# Altium schematic sheet PowerSupply-SCH_SH2_(A).SchDoc: SCHEMATIC
size 863 x 558 mm; SheetNumber: 2; SheetTotal: 2; PageSetup: Record=PageOptions|CenterHorizontal=True|CenterVertical=True|PrintScale=0.98|XCorrection=1.00|YCorrection=1.00|PrintKind=2|BorderSize=5000000|LeftOffset=0|BottomOffset=0|Orientation=2|PaperLength=1000|PaperWidth=1000|Scale=100|PaperSource=15|PrintQuality=1200|MediaType=1|DitherType=10|PaperKind=11 x 17|PrintScaleMode=1
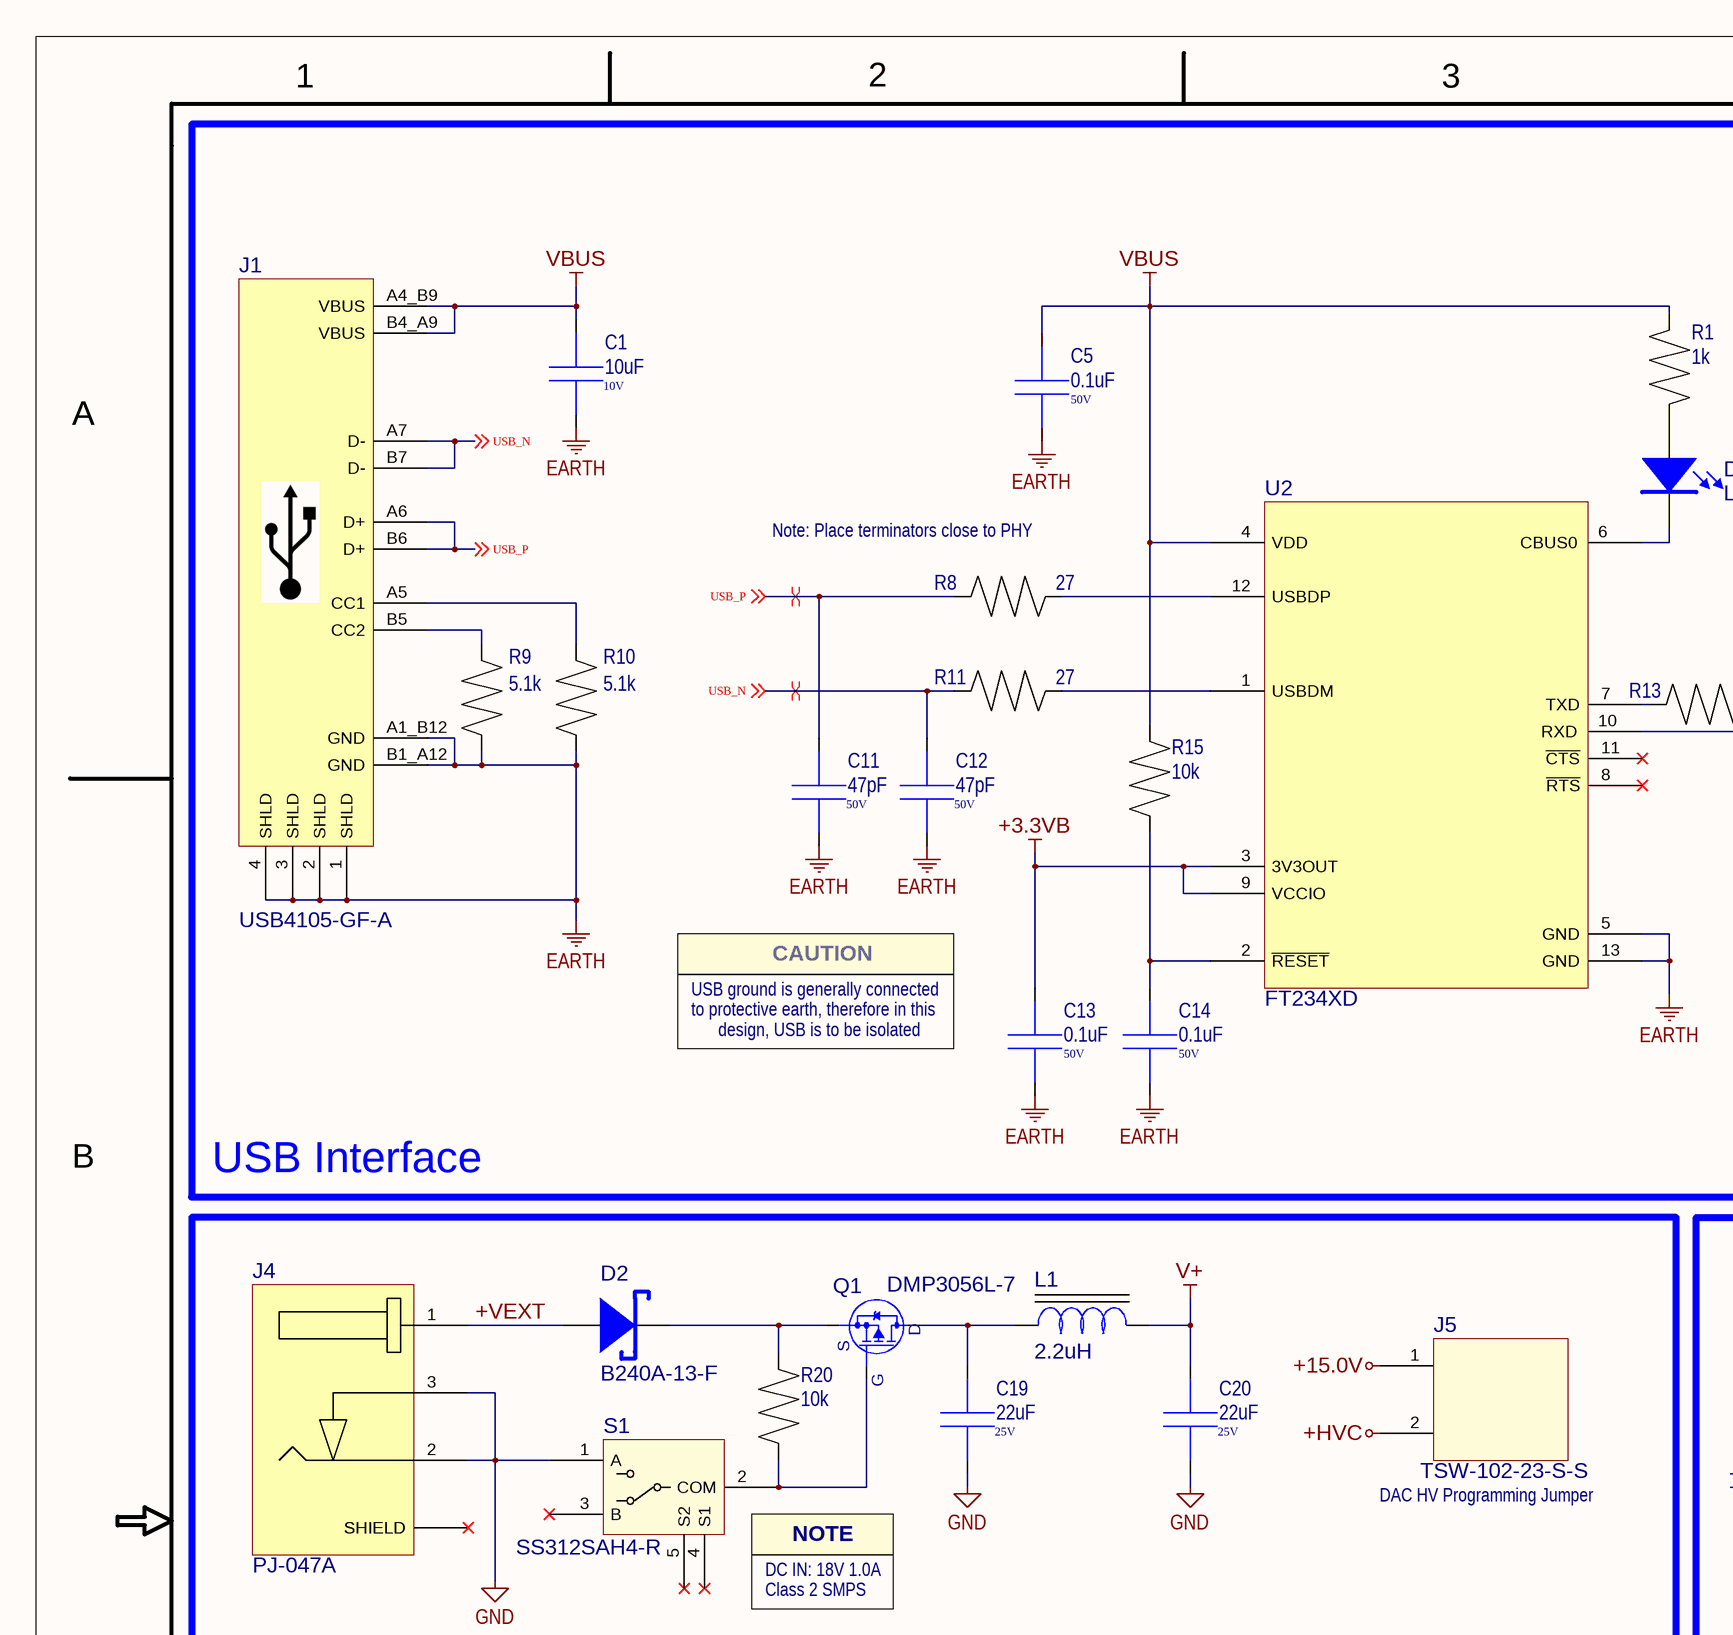
[diagram p0: PowerSupply-SCH_SH2_(A).SchDoc, top left]
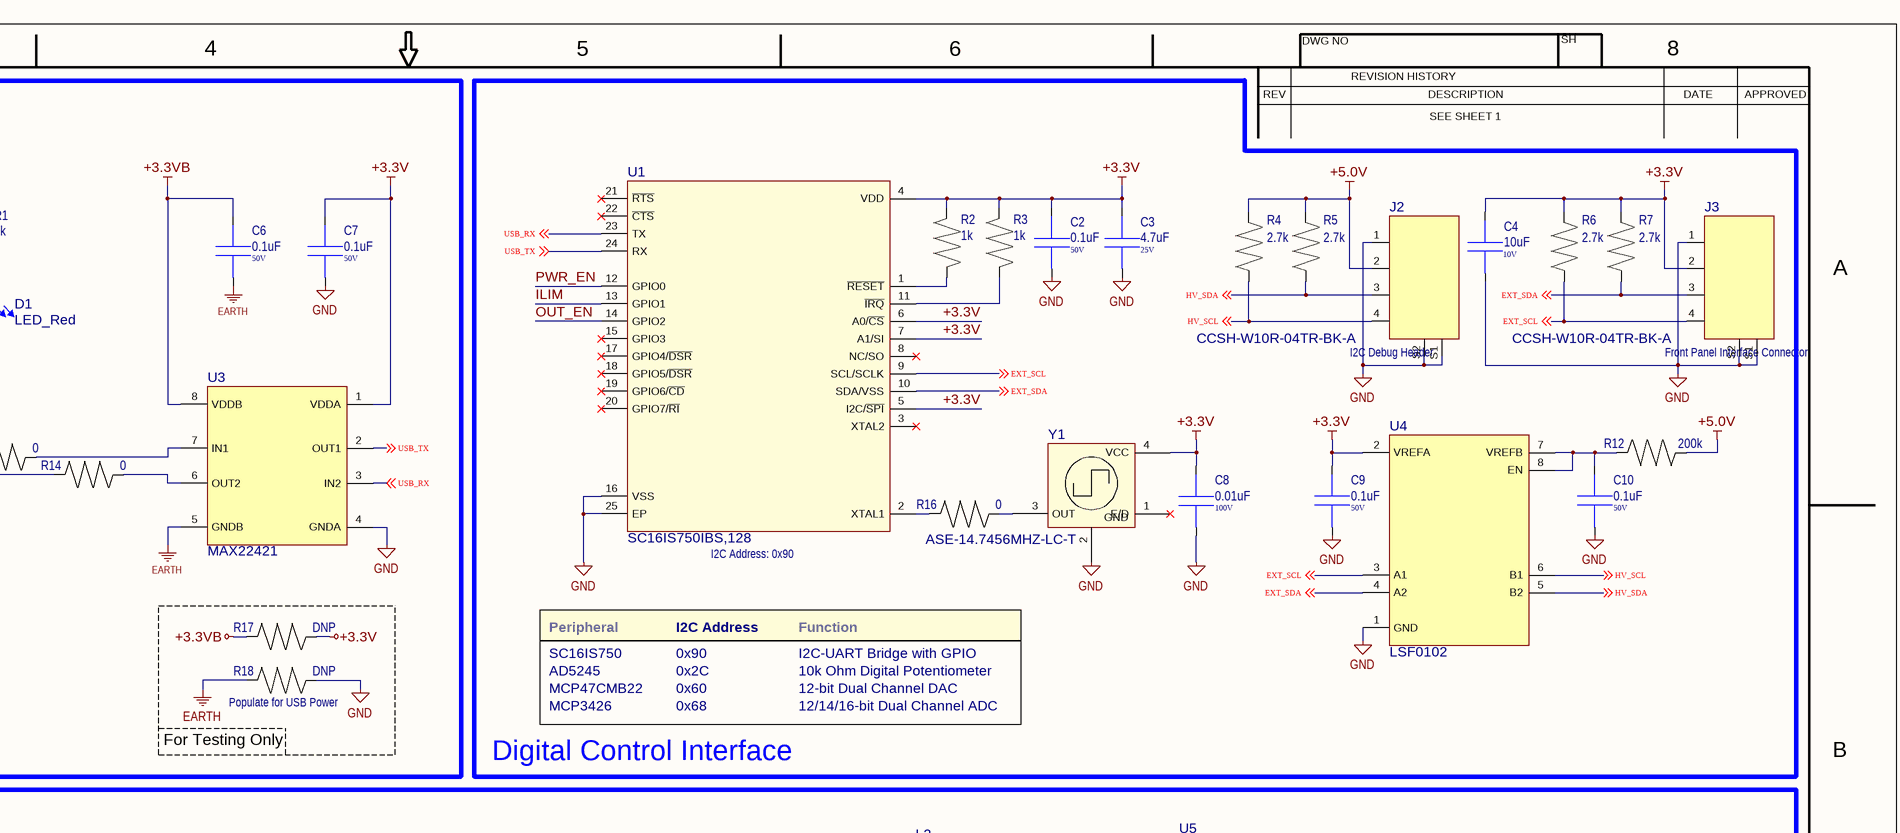
[diagram p1: PowerSupply-SCH_SH2_(A).SchDoc, top right]
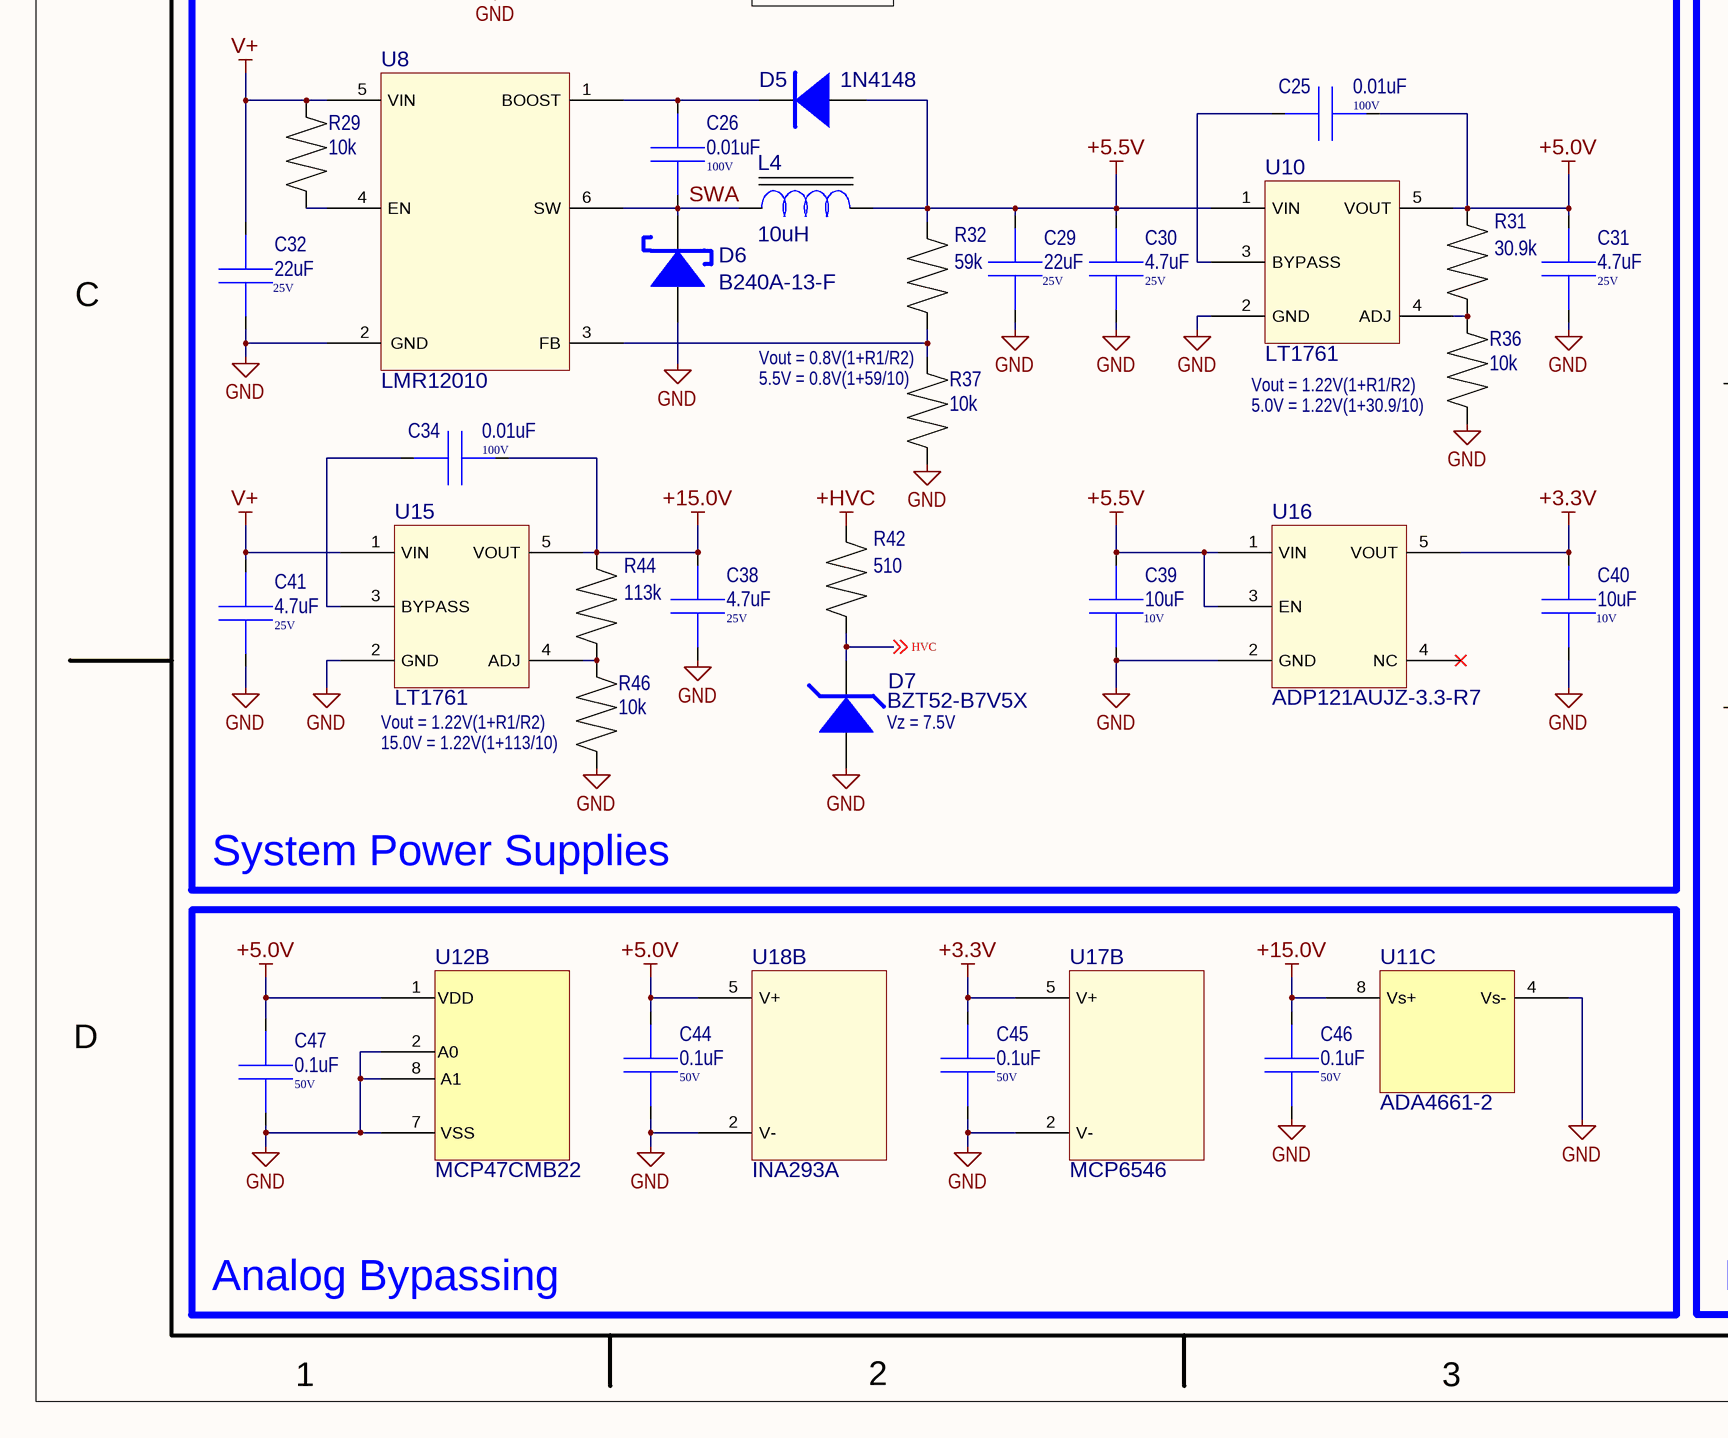
[diagram p2: PowerSupply-SCH_SH2_(A).SchDoc, bottom left]
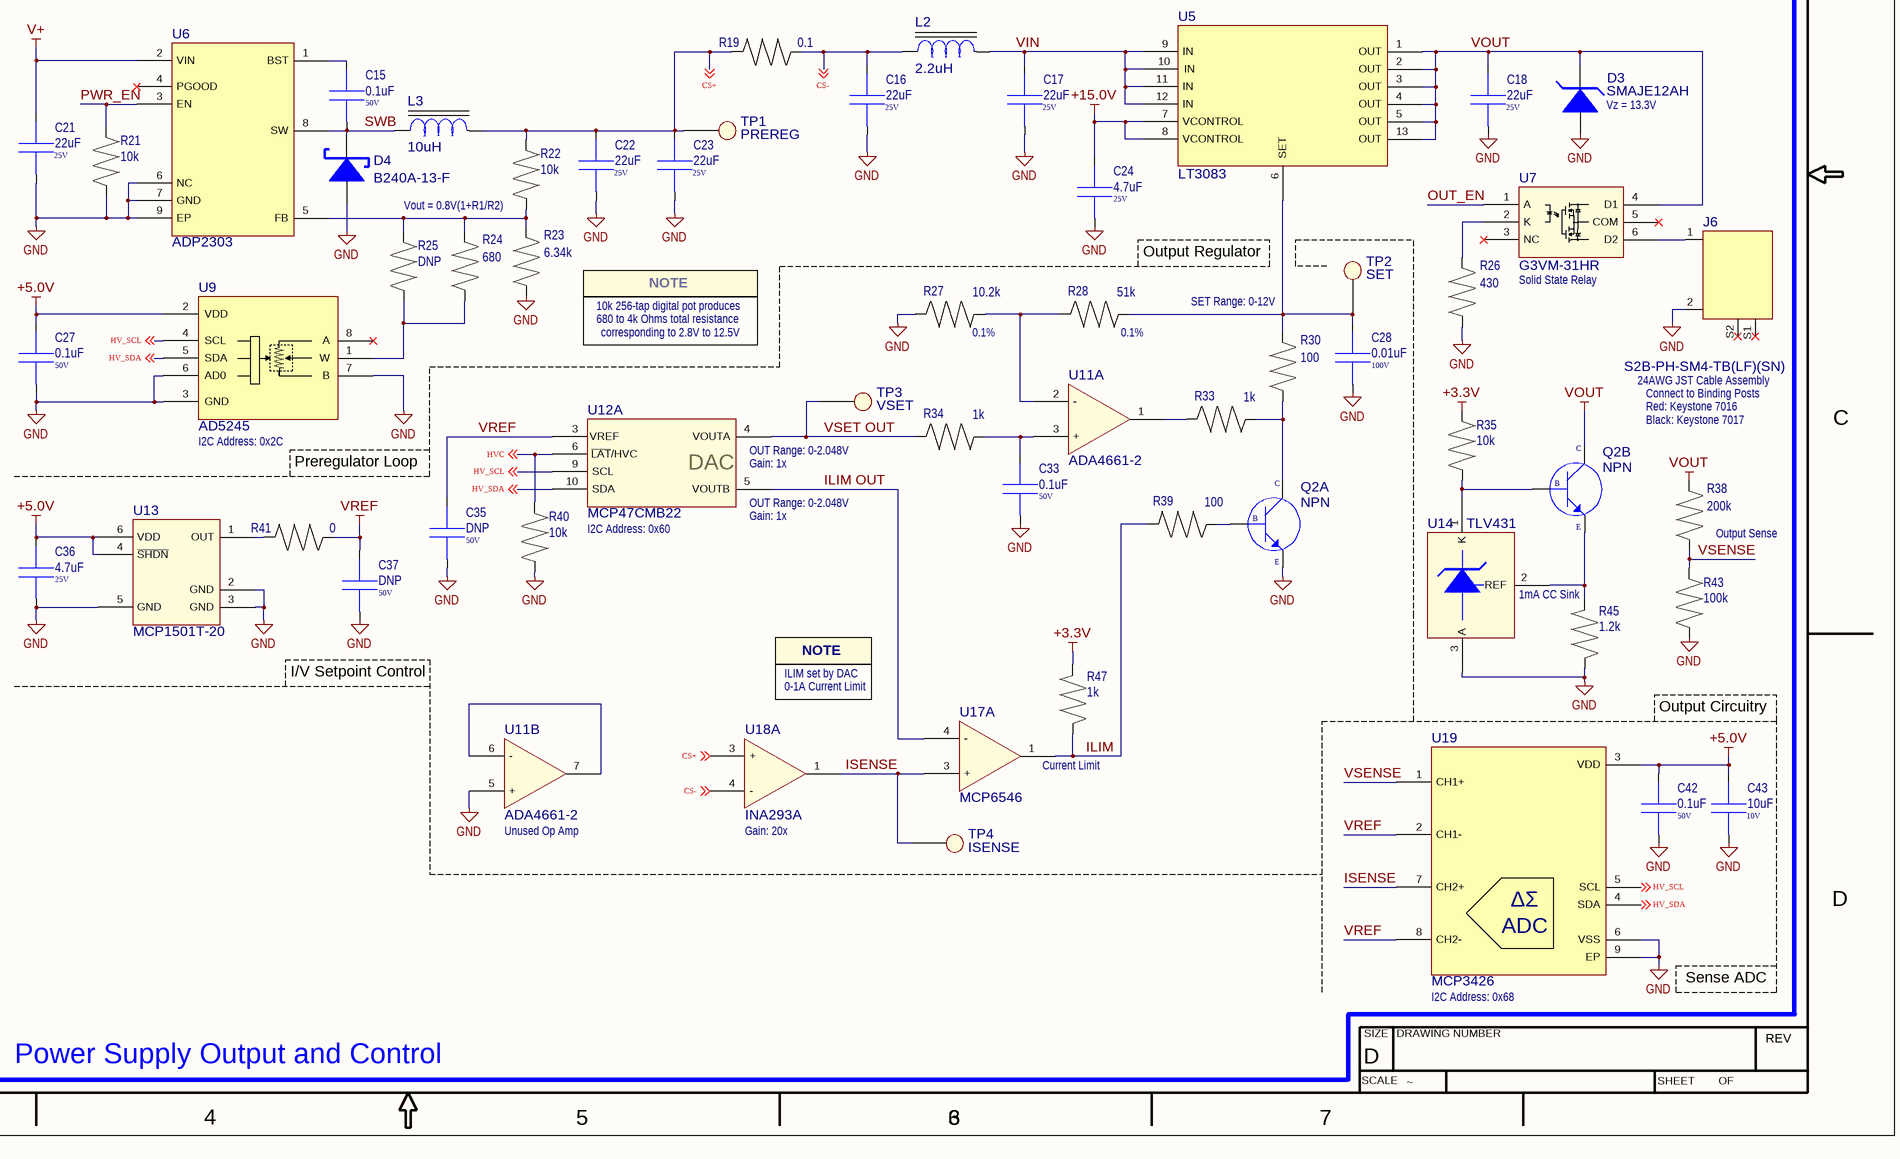
[diagram p3: PowerSupply-SCH_SH2_(A).SchDoc, bottom right]

## Parts
C1  10uF  Voltage: 10V  [0402]
C2  0.1uF  Voltage: 50V  [0402]
C3  4.7uF  Voltage: 25V  [0402]
C4  10uF  Voltage: 10V  [0402]
C5  0.1uF  Voltage: 50V  [0402]
C6  0.1uF  Voltage: 50V  [0402]
C7  0.1uF  Voltage: 50V  [0402]
C8  0.01uF  Voltage: 100V  [0402]
C9  0.1uF  Voltage: 50V  [0402]
C10  0.1uF  Voltage: 50V  [0402]
C11  47pF  Voltage: 50V  [0402]
C12  47pF  Voltage: 50V  [0402]
C13  0.1uF  Voltage: 50V  [0402]
C14  0.1uF  Voltage: 50V  [0402]
C15  0.1uF  Voltage: 50V  [0402]
C16  22uF  Voltage: 25V  [0805]
C17  22uF  Voltage: 25V  [0805]
C18  22uF  Voltage: 25V  [0805]
C19  22uF  Voltage: 25V  [0805]
C20  22uF  Voltage: 25V  [0805]
C21  22uF  Voltage: 25V  [0805]
C22  22uF  Voltage: 25V  [0805]
C23  22uF  Voltage: 25V  [0805]
C24  4.7uF  Voltage: 25V  [0402]
C25  0.01uF  Voltage: 100V  [0402]
C26  0.01uF  Voltage: 100V  [0402]
C27  0.1uF  Voltage: 50V  [0402]
C28  0.01uF  Voltage: 100V  [0402]
C29  22uF  Voltage: 25V  [0805]
C30  4.7uF  Voltage: 25V  [0402]
C31  4.7uF  Voltage: 25V  [0402]
C32  22uF  Voltage: 25V  [0805]
C33  0.1uF  Voltage: 50V  [0402]
C34  0.01uF  Voltage: 100V  [0402]
C35  DNP  Voltage: 50V  [0402]
C36  4.7uF  Voltage: 25V  [0402]
C37  DNP  Voltage: 50V  [0402]
C38  4.7uF  Voltage: 25V  [0402]
C39  10uF  Voltage: 10V  [0402]
C40  10uF  Voltage: 10V  [0402]
C41  4.7uF  Voltage: 25V  [0402]
C42  0.1uF  Voltage: 50V  [0402]
C43  10uF  Voltage: 10V  [0402]
C44  0.1uF  Voltage: 50V  [0402]
C45  0.1uF  Voltage: 50V  [0402]
C46  0.1uF  Voltage: 50V  [0402]
C47  0.1uF  Voltage: 50V  [0402]
D1  LED_Red  [0603_LED_Red]
D2  B240A-13-F  [SMA]
D3  SMAJE12AH  [SMA]
D4  B240A-13-F  [SMA]
D5  1N4148  [SOD-323]
D6  B240A-13-F  [SMA]
D7  BZT52-B7V5X  [SOD-123]
J1  USB4105-GF-A  [USB4105-GF-A]
J2  CCSH-W10R-04TR-BK-A  [CCSH-W10R-04TR-BK-A]
J3  CCSH-W10R-04TR-BK-A  [CCSH-W10R-04TR-BK-A]
J4  PJ-047A  [PJ-047A]
J5  TSW-102-23-S-S  [TSW-102-xx-L-S]
J6  S2B-PH-SM4-TB(LF)(SN)  [S2B-PH-SM4-TB(LF)(SN)]
L1  2.2uH  [0806AZ]
L2  2.2uH  [0806AZ]
L3  10uH  [WURTH_WE-LHMI]
L4  10uH  [XFL4020-xxxMEx]
Q1  DMP3056L-7  [SOT-23]
Q2  NPN  [SOT-666]  (parts A,B of 2)
R1  1k  [0402]
R2  1k  [0402]
R3  1k  [0402]
R4  2.7k  [0402]
R5  2.7k  [0402]
R6  2.7k  [0402]
R7  2.7k  [0402]
R8  27  [0402]
R9  5.1k  [0402]
R10  5.1k  [0402]
R11  27  [0402]
R12  200k  [0402]
R13  0  [0402]
R14  0  [0402]
R15  10k  [0402]
R16  0  [0402]
R17  DNP  [0603]
R18  DNP  [0603]
R19  0.1  [0603]
R20  10k  [0402]
R21  10k  [0402]
R22  10k  [0402]
R23  6.34k  [0402]
R24  680  [0402]
R25  DNP  [0402]
R26  430  [0402]
R27  10.2k  [0402]
R28  51k  [0402]
R29  10k  [0402]
R30  100  [0402]
R31  30.9k  [0402]
R32  59k  [0402]
R33  1k  [0402]
R34  1k  [0402]
R35  10k  [0402]
R36  10k  [0402]
R37  10k  [0402]
R38  200k  [0402]
R39  100  [0402]
R40  10k  [0402]
R41  0  [0402]
R42  510  [0603]
R43  100k  [0402]
R44  113k  [0402]
R45  1.2k  [0402]
R46  10k  [0402]
R47  1k  [0402]
S1  SS312SAH4-R  [SW_SS312SAH4-R]
TP1  PREREG  [30-40 Drill]  (no BOM)
TP2  SET  [30-40 Drill]  (no BOM)
TP3  VSET  [30-40 Drill]  (no BOM)
TP4  ISENSE  [30-40 Drill]  (no BOM)
U1  SC16IS750IBS,128  [24-HVQFN (4x4)]
U2  FT234XD  [DFN-12]
U3  MAX22421  [SOIC-8]
U4  LSF0102  [SOT-765]
U5  LT3083  [DFN-12_4x4]
U6  ADP2303  [SOIC-8 EP]
U7  G3VM-31HR  [SOP-6]
U8  LMR12010  [TSOT-23-6]
U9  AD5245  [TSOT-8]
U10  LT1761  [TSOT23-5]
U11  ADA4661-2  [MSOP-8]  (parts A,B,C of 3)
U12  MCP47CMB22  [MSOP-10]  (parts A,B of 2)
U13  MCP1501T-20  [TSOT-23-6]
U14  TLV431  [SOT-23-3]
U15  LT1761  [TSOT23-5]
U16  ADP121AUJZ-3.3-R7  [TSOT23-5]
U17  MCP6546  [TSOT-23-5]  (parts A,B of 2)
U18  INA293A  [TSOT-23-5]  (parts A,B of 2)
U19  MCP3426  [DFN-8_2x3]
Y1  ASE-14.7456MHZ-LC-T  [ASE-XXXXX-X-X-X]

## Blocks framed on the sheet
USB Interface: C1 C5-C7 C11-C14 D1 J1 R1 R8-R11 R13-R15 U2 U3
Digital Control Interface: C2-C4 C8-C10 J2 J3 R2-R7 R12 R16 U1 U4 Y1
For Testing Only: R17 R18
System Power Supplies: C19 C20 C25 C26 C29-C32 C34 C38-C41 D2 D5-D7 J4 J5 L1 L4 Q1 R20 R29 R31 R32 R36 R37 R42 R44 R46 S1 U8 U10 U15 U16
Power Supply Output and Control: C15-C18 C21-C24 C27 C28 C33 C35-C37 C42 C43 D3 D4 J6 L2 L3 Q2 R19 R21-R28 R30 R33-R35 R38-R41 R43 R45 R47 TP1-TP4 U5-U7 U9 U11-U14 U17-U19
Analog Bypassing: C44-C47 U11 U12 U17 U18

## Nets
+3.3V: C2.2 C3.2 C4.2 C7.2 C8.2 C9.2 C40.2 C45.2 J3.2 R2.2 R3.2 R6.2 R7.2 R17.1 R35.1 R47.2 U1.4(VDD) U1.5(I2C/~{SPI}) U1.6(A0/~{CS}) U1.7(A1/SI) U3.1(VDDA) U4.2(VREFA) U16.5(VOUT) U17.5(V+) Y1.4(VCC)
+3.3VB: C6.2 C13.2 R17.2 U2.3(3V3OUT) U2.9(VCCIO) U3.8(VDDB)
+5.0V: C25.1 C27.2 C31.2 C36.2 C42.2 C43.2 C44.2 C47.2 J2.2 R4.2 R5.2 R12.2 R31.2 U9.2(VDD) U10.5(VOUT) U12.1(VDD) U13.4(~{SHDN}) U13.6(VDD) U18.5(V+) U19.3(VDD)
+5.5V: C29.2 C30.2 C39.2 D5.1(A) L4.2 R32.2 U10.1(VIN) U16.1(VIN) U16.3(EN)
+15.0V: C24.2 C34.1 C38.2 C46.2 J5.1 R44.2 U5.7(VCONTROL) U5.8(VCONTROL) U11.8(Vs+) U15.5(VOUT)
+HVC: J5.2 R42.2
EARTH: C1.1 C5.1 C6.1 C11.1 C12.1 C13.1 C14.1 J1.1(SHLD) J1.2(SHLD) J1.3(SHLD) J1.4(SHLD) J1.A1_B12(GND) J1.B1_A12(GND) R9.1 R10.1 R18.2 U2.5(GND) U2.13(GND) U3.5(GNDB)
GND: C2.1 C3.1 C4.1 C7.1 C8.1 C9.1 C10.1 C16.1 C17.1 C18.1 C19.1 C20.1 C21.1 C22.1 C23.1 C24.1 C27.1 C28.1 C29.1 C30.1 C31.1 C32.1 C33.1 C35.1 C36.1 C37.1 C38.1 C39.1 C40.1 C41.1 C42.1 C43.1 C44.1 C45.1 C46.1 C47.1 D3.1(A) D4.1(A) D6.1(A) D7.1(A) J2.1 J2.S1 J2.S2 J3.1 J3.S1 J3.S2 J4.2 J4.3 J6.2 Q2.1(E) R18.1 R21.2 R23.1 R26.1 R27.1 R36.2 R37.2 R40.2 R43.2 R45.1 R46.2 S1.1(A) U1.16(VSS) U1.25(EP) U3.4(GNDA) U4.1(GND) U6.6(NC) U6.7(GND) U6.9(EP) U8.2(GND) U9.3(GND) U9.6(AD0) U9.7(B) U10.2(GND) U11.4(Vs-) U11.5(+) U12.2(A0) U12.7(VSS) U12.8(A1) U13.2(GND) U13.3(GND) U13.5(GND) U14.3(A) U15.2(GND) U16.2(GND) U17.2(V-) U18.2(V-) U19.6(VSS) U19.9(EP) Y1.2(GND)
V+: C20.2 C21.2 C32.2 C41.2 L1.2 R29.1 U6.2(VIN) U8.5(VIN) U15.1(VIN)
VBUS: C1.2 C5.2 J1.A4_B9(VBUS) J1.B4_A9(VBUS) R1.2 R15.1 U2.4(VDD)
VOUT: C18.2 D3.2(K) Q2.3(C) R38.2 U5.1(OUT) U5.2(OUT) U5.3(OUT) U5.4(OUT) U5.5(OUT) U5.13(OUT) U7.4(D1)
VREF: C35.2 C37.2 R41.1 U12.3(VREF) U19.2(CH1-) U19.8(CH2-)
+VEXT: D2.1(A) J4.1
CS+: C22.2 C23.2 L3.2 R19.2 R22.1 TP1.1 U18.3(+) ; off-sheet CS+
CS-: C16.2 L2.1 R19.1 U18.4(-) ; off-sheet CS-
EXT_SCL: J3.4 R6.1 U1.9(SCL/SCLK) U4.3(A1) ; off-sheet EXT_SCL
EXT_SDA: J3.3 R7.1 U1.10(SDA/VSS) U4.4(A2) ; off-sheet EXT_SDA
HV_SCL: J2.4 R4.1 U4.6(B1) U9.4(SCL) U12.9(SCL) U19.5(SCL) ; off-sheet HV_SCL
HV_SDA: J2.3 R5.1 U4.5(B2) U9.5(SDA) U12.10(SDA) U19.4(SDA) ; off-sheet HV_SDA
HVC: D7.2(K) R40.1 R42.1 U12.6(~{LAT}/HVC) ; off-sheet HVC
ILIM: R39.2 R47.1 U1.13(GPIO1) U17.1(OUT)
ILIM OUT: U12.5(VOUTB) U17.4(-)
ISENSE: TP4.1 U17.3(+) U18.1(OUT) U19.7(CH2+)
OUT_EN: U1.14(GPIO2) U7.1(A)
PWR_EN: R21.1 U1.12(GPIO0) U6.3(EN)
SWA: C26.1 D6.2(K) L4.1 U8.6(SW)
SWB: C15.1 D4.2(K) L3.1 U6.8(SW)
USB_N: C12.2 J1.A7(D-) J1.B7(D-) R11.1 ; off-sheet USB_N
USB_P: C11.2 J1.A6(D+) J1.B6(D+) R8.1 ; off-sheet USB_P
USB_RX: U1.23(TX) U3.3(IN2) ; off-sheet USB_RX
USB_TX: U1.24(RX) U3.2(OUT1) ; off-sheet USB_TX
VIN: C17.2 L2.2 U5.9(IN) U5.10(IN) U5.11(IN) U5.12(IN)
VSENSE: R38.1 R43.1 U19.1(CH1+)
VSET OUT: R34.1 TP3.1 U12.4(VOUTA)
NetC10_2: C10.2 R12.1 U4.7(VREFB) U4.8(EN)
NetC14_2: C14.2 R15.2 U2.2(~{RESET})
NetC15_2: C15.2 U6.1(BST)
NetC19_2: C19.2 L1.1 Q1.2(D)
NetC25_2: C25.2 U10.3(BYPASS)
NetC26_2: C26.2 D5.2(K) U8.1(BOOST)
NetC28_2: C28.2 R28.2 R30.2 TP2.1 U5.6(SET)
NetC33_2: C33.2 R34.2 U11.3(+)
NetC34_2: C34.2 U15.3(BYPASS)
NetD1_1: D1.1(A) R1.1
NetD1_2: D1.2(K) U2.6(CBUS0)
NetD2_2: D2.2(K) Q1.3(S) R20.1
NetJ1_A5: J1.A5(CC1) R10.2
NetJ1_B5: J1.B5(CC2) R9.2
NetJ4_4: J4.4(SHIELD) J4.5(SHIELD)
NetJ6_1: J6.1 U7.6(D2)
NetQ1_1: Q1.1(G) R20.2 S1.2(COM)
NetQ2_2: Q2.2(B) R39.1
NetQ2_4: Q2.4(E) R45.2 U14.2(REF)
NetQ2_5: Q2.5(B) R35.2 U14.1(K)
NetQ2_6: Q2.6(C) R30.1 R33.2
NetR2_1: R2.1 U1.1(~{RESET})
NetR3_1: R3.1 U1.11(~{IRQ})
NetR8_2: R8.2 U2.12(USBDP)
NetR11_2: R11.2 U2.1(USBDM)
NetR13_1: R13.1 U3.7(IN1)
NetR13_2: R13.2 U2.7(TXD)
NetR14_1: R14.1 U3.6(OUT2)
NetR14_2: R14.2 U2.10(RXD)
NetR16_1: R16.1 Y1.3(OUT)
NetR16_2: R16.2 U1.2(XTAL1)
NetR22_2: R22.2 R23.2 R24.2 R25.1 U6.5(FB)
NetR24_1: R24.1 R25.2 U9.1(W)
NetR26_2: R26.2 U7.2(K)
NetR27_2: R27.2 R28.1 U11.2(-)
NetR29_2: R29.2 U8.4(EN)
NetR31_1: R31.1 R36.1 U10.4(ADJ)
NetR32_1: R32.1 R37.1 U8.3(FB)
NetR33_1: R33.1 U11.1(OUT)
NetR41_2: R41.2 U13.1(OUT)
NetR44_1: R44.1 R46.1 U15.4(ADJ)
NetU11_6: U11.6(-) U11.7(OUT)

Not connected (* = marked no-connect by the designer): J6 S1* S2*; S1 3(B)* 4(S1)* 5(S2)*; U1 3(XTAL2)* 8(NC/SO)* 15(GPIO3)* 17(GPIO4/~{DSR})* 18(GPIO5/~{DSR})* 19(GPIO6/~{CD})* 20(GPIO7/~{RI})* 21(~{RTS})* 22(~{CTS})*; U2 8(~{RTS})* 11(~{CTS})*; U6 4(PGOOD)*; U7 3(NC)* 5(COM)*; U9 8(A)*; U16 4(NC)*; Y1 1(E/D)*

## Layout directives
differential pair: USB_N, USB_P

## Notes on the sheet
- 1
- 2
- 3
- 4
- 5
- 6
- DWG NO
- REVISION HISTORY
- SH
- 8
- REV
- DESCRIPTION
- SEE SHEET 1
- DATE
- APPROVED
- A
- Note: Place terminators close to PHY
- I2C Debug Header
- Front Panel Interface Connector
- (near U1) I2C Address: 0x90
- (near C13) USB ground is generally connected
- CAUTION
- Peripheral
- I2C Address
- Function
- (near C13) to protective earth, therefore in this
- (near C13) design, USB is to be isolated
- MCP47CMB22
- AD5245
- SC16IS750
- 0x90
- 0x60
- 0x2C
- I2C-UART Bridge with GPIO
- 10k Ohm Digital Potentiometer
- 12-bit Dual Channel DAC
- (near R18) Populate for USB Power
- MCP3426
- 0x68
- 12/14/16-bit Dual Channel ADC
- B
- (near D3) Vz = 13.3V
- NOTE
- (near J5) DAC HV Programming Jumper
- (near S1) DC IN: 18V 1.0A
- Class 2 SMPS
- (near R22) Vout = 0.8V(1+R1/R2)
- Output Regulator
- 10k 256-tap digital pot produces
- (near R30) SET Range: 0-12V
- (near U7) Solid State Relay
- 680 to 4k Ohms total resistance
- corresponding to 2.8V to 12.5V
- (near R27) 0.1%
- (near R28) 0.1%
- 24AWG JST Cable Assembly
- Connect to Binding Posts
- C
- (near U9) I2C Address: 0x2C
- (near U12) OUT Range: 0-2.048V
- Red: Keystone 7016
- Black: Keystone 7017
- (near R37) Vout = 0.8V(1+R1/R2)
- (near R37) 5.5V = 0.8V(1+59/10)
- (near R36) Vout = 1.22V(1+R1/R2)
- (near R36) 5.0V = 1.22V(1+30.9/10)
- Preregulator Loop
- (near U12) Gain: 1x
- I2C Address: 0x60
- (near R38) Output Sense
- 1mA CC Sink
- (near R46) Vout = 1.22V(1+R1/R2)
- (near R46) 15.0V = 1.22V(1+113/10)
- (near D7) Vz = 7.5V
- I/V Setpoint Control
- ILIM set by DAC
- 0-1A Current Limit
- Output Circuitry
- Current Limit
- (near U11) Unused Op Amp
- (near U18) Gain: 20x
- D
- (near U19) I2C Address: 0x68
- Sense ADC
- SIZE
- DRAWING NUMBER
- SCALE
- ~
- SHEET        OF
- 7
- (in symbol MCP47CMB22, part A) DAC
- (in symbol MCP3426) ΔΣ; ADC

## Library data of the parts
C1 C4 C39 C40 C43 = CAP: CAP CER 10UF 10V X5R 0402; Part Number: CL05A106MP8NUB8; Manufacturer: Samsung Electro-Mechanics; ClassName: -
C2 C5-C7 C9 C10 C13-C15 C27 C35 C37 C42 C44-C47 = CAP: CAP CER 0.1UF 50V X7R 0402; Part Number: UMK105B7104KVHF; Manufacturer: Taiyo Yuden
  C2 C5 C9 C10 C13 C14: ClassName: -
  C6 C7 C15 C27 C35 C37 C42 C44-C47: ClassName: *
C3 C24 C30 C31 C36 C38 C41 = CAP: CAP MLCC 4.7UF 25V X5S 0402; Part Number: GRM155C61E475ME15J; Manufacturer: Murata Electronics; ClassName: -
C8 C25 C26 C28 C34 = CAP: CAP CER 0.01UF 100V X7R 0402; Part Number: HMR105B7103MV-F; Manufacturer: Taiyo Yuden
  C8: ClassName: -
  C25 C26 C28 C34: ClassName: *
C11 C12 = CAP: CAP CER 47PF 50V X7R 0402; Part Number: C0402C470K5RACAUTO; Manufacturer: KEMET; ClassName: -
C16-C23 C29 C32 = CAP: CAP CER 22UF 25V X5R 0805; Part Number: CL21A226MAYNNNE; Manufacturer: Samsung Electro-Mechanics
  C16-C18 C21-C23 C29 C32: ClassName: *
C33 = CAP: CAP CER 0.1UF 50V X7R 0603; Part Number: C0603C104K5RAC3121; Manufacturer: KEMET; ClassName: *
D1 = LED_Red: LED HE RD 0603; Part Number: SM0603HCL; Manufacturer: Bivar; ClassName: -
D2 D4 D6 = DIODE_SCHOTTKY: DIODE SCHOTTKY 40V 2A SMA; Manufacturer: Diodes Incorporated; Part Number: B240A-13-F
  D4 D6: ClassName: *
D3 = DIODE_ZENER: TVS DIODE 12VWM UNI; Manufacturer: Eaton - Electronics Division; Part Number: SMAJE12AH; ClassName: *
D5 = DIODE: DIODE GEN PURP 75V 150MA SOD323; Part Number: 1N4148WS-G RVG; Manufacturer: Taiwan Semiconductor; ClassName: *
D7 = DIODE_ZENER: DIODE ZENER 7.5V 590MW SOD123; Manufacturer: Nexperia USA Inc.; Part Number: BZT52-B7V5X; ClassName: *
J1 = USB4105-GF-A: CONN RCP USB2.0 TYP C 24P SMD RA; Manufacturer: GCT; Part Number: USB4105-GF-A
J2 J3 = CCSH-W10R-04TR-BK-A: JST 4 PIN SMT CONN; Manufacturer: JST; Part Number: CCSH-W10R-04TR-BK-A
J4 = PJ-047A: CON PWR JCK 2.0 X 6.0MM W/SHLD 2.5A; Manufacturer: CUI Inc; Part Number: PJ-047A
J5 = TSW-102-xx-L-S: CONN MALE HEADER 2 POS .100" T/H GOLD UNSHROUDED; Manufacturer: Samtec; Part Number: TSW-102-23-S-S; ClassName: *
J6 = S2B-PH-SM4-TB(LF)(SN): CONN HEADER SMD R/A 2POS 2MM; Manufacturer: JST Sales America Inc.; Part Number: S2B-PH-SM4-TB(LF)(SN)
L1 L2 = SHIELDED_INDUCTOR: FIXED IND 2.2UH 1.8A 139MOHM SMD; Part Number: CIGT201610LH2R2MNE; Manufacturer: Samsung Electro-Mechanics
  L2: ClassName: *
L3 = SHIELDED_INDUCTOR: FIXED IND 10UH 5.2A 30 MOHM SMD; Part Number: 74437368100; Manufacturer: Würth Elektronik; ClassName: *
L4 = SHIELDED_INDUCTOR: FIXED IND 10UH 850MA 185MOHM SMD; Part Number: VLCF4020T-100MR85; Manufacturer: TDK; ClassName: *
Q1 = MOSFET_P: MOSFET P-CH 30V 4.3A SOT23; Manufacturer: Diodes Incorporated; Part Number: DMP3056L-7
Q2 = NPN_DUAL: TRANS 2NPN 45V 0.1A SOT666; Manufacturer: Nexperia USA; Part Number: BCM847BV,115; ClassName: *
R1-R3 R47 = RES: RES 1K OHM 1% 1/16W 0402; Part Number: CR0402AFX-1001GLF; Manufacturer: Bourns; ClassName: -
R4-R7 = RES: RES SMD 2.7K OHM 1% 1/10W 0402; Part Number: ERJ-2RKF2701X; Manufacturer: Panasonic
R8 R11 = RES: RES SMD 27 OHM 1% 1/10W 0402; Part Number: ERJ-2RKF27R0X; Manufacturer: Panasonic; ClassName: -
R9 R10 = RES: RES SMD 5.1K OHM 1% 1/16W 0402; Part Number: CRCW04025K10FKED; Manufacturer: Vishay / Dale; ClassName: -
R12 R38 = RES: RES SMD 200K OHM 1% 1/16W 0402; Part Number: CR0402-FX-2003GLF; Manufacturer: Bourns
  R38: ClassName: *
R13 R14 R16 R25 R41 = RES: RES 0 OHM JUMPER 1/16W 0402; Part Number: CRCW04020000Z0EDC; Manufacturer: Vishay / Dale; ClassName: -
R15 R20-R22 R29 R35-R37 R40 R46 = RES: RES SMD 10K OHM 1% 1/16W 0402; Part Number: CR0402-FX-1002GLF; Manufacturer: Bourns; ClassName: -
R17 R18 = RES: RES SMD 0 OHM JUMPER 1/3W 0603; Part Number: CRCW06030000Z0EAHP; Manufacturer: Vishay / Dale; ClassName: -
R19 = RES: RES 0.1 OHM 1% 1/10W 0603; Part Number: ERJ-3RSFR10V; Manufacturer: Panasonic Electronic Components; ClassName: *
R23 = RES: RES SMD 6.34K OHM 1% 1/16W 0402; Part Number: ERJ-U02F6341X; Manufacturer: Panasonic; ClassName: *
R24 = RES: RES SMD 680 OHM 1% 1/16W 0402; Part Number: CR0402-FX-6800GLF; Manufacturer: Bourns; ClassName: *
R26 = RES: RES SMD 430 OHM 1% 1/16W 0402; Part Number: CR0402-FX-4300GLF; Manufacturer: Bourns Inc.; ClassName: *
R27 = RES: RES SMD 10.2K OHM 0.1% 1/16W 0402; Part Number: ERA-2APB1022X; Manufacturer: Panasonic; ClassName: *
R28 = RES: RES SMD 51K OHM 0.1% 1/16W 0402; Part Number: ERA-2AEB513X; Manufacturer: Panasonic; ClassName: *
R30 R39 = RES: RES SMD 100 OHM 1% 1/16W 0402; Part Number: ERJ-2RKF1000X; Manufacturer: Panasonic; ClassName: *
R31 = RES: RES SMD 30.9K OHM 1% 1/16W 0402; Part Number: ERJ-2RKF3092X; Manufacturer: Panasonic; ClassName: *
R32 = RES: RES SMD 59K OHM 1% 1/16W 0402; Part Number: CRCW040259K0FKEDC; Manufacturer: Vishay / Dale; ClassName: *
R33 R34 = RES: RES SMD 1K OHM 1% 1/16W 0402; Part Number: CR0402AFX-1001GLF; Manufacturer: Bourns; ClassName: *
R42 = RES: RES 510 OHM 1% 1/10W 0603; Part Number: RC0603FR-07510RL; Manufacturer: YAGEO; ClassName: *
R43 = RES: RES SMD 100K OHM 1% 1/16W 0402; Part Number: CR0402-FX-1003GLF; Manufacturer: Bourns; ClassName: -
R44 = RES: RES SMD 113K OHM 1% 1/16W 0402; Part Number: CRCW0402113KFKED; Manufacturer: Vishay / Dale; ClassName: *
R45 = RES: RES SMD 1.2K OHM 1% 1/16W 0402; Part Number: CR0402-FX-1201GLF; Manufacturer: Bourns; ClassName: -
S1 = SS312SAH4-R: SWITCH SLIDE SPDT 0.4VA 28V; Manufacturer: NKK Switches; Part Number: SS312SAH4-R
TP1-TP4 = TEST-POINT
U1 = SC16IS750IBS,128: IC UART I2C/SPI 24-HVQFN; Manufacturer: NXP USA Inc.; Part Number: SC16IS750IBS,128
U2 = FT234XD: IC USB SERIAL BASIC UART 12DFN; Part Number: FT234XD-R; Manufacturer: FTDI
U3 = MAX22421: 2-CH 3KVRMS DIGITAL ISOLATOR; Part Number: MAX22421BASA+; Manufacturer: Maxim Integrated
U4 = LSF0102: IC TRNSLTR BIDIRECTIONAL 8VSSOP; Part Number: LSF0102QDCURQ1; Manufacturer: Texas Instruments
U5 = LT3083: Linear Voltage Regulator IC Positive Adjustable 1 Output 3A 12-DFN (4x4); Manufacturer: Analog Devices Inc.; Part Number: LT3083EDF#PBF
U6 = ADP2303: IC REG BUCK ADJUSTABLE 3A 8SOIC; Part Number: ADP2303ARDZ; Manufacturer: Analog Devices Inc.
U7 = G3VM-31HR: SSR RELAY SPST-NO 4A 0-30V; Manufacturer: Omron Electronics Inc-EMC Div; Part Number: G3VM-31HR
U8 = LMR12010: IC REG BUCK ADJ 1A TSOT23-6; Manufacturer: Texas Instruments; Part Number: LMR12010XMKE/NOPB
U9 = AD5245: IC DGTL POT xKOHM 256TAP SOT23-8; Part Number: AD5245BRJZ10-R2; Manufacturer: Analog Devices Inc.
U10 U15 = LT1761ES5-BYP#TRMPBF: IC REG LDO ADJ 0.1A TSOT23-5; Manufacturer: Linear Technology; Part Number: LT1761ES5-BYP#TRMPBF
U11 = AD8072: IC CMOS 2 CIRCUIT 8MSOP; Part Number: ADA4661-2ARMZ-R7; Manufacturer: Analog Devices Inc.
U12 = MCP47CMB22: IC DAC 12BIT DUAL V-OUT 10MSOP; Manufacturer: Microchip Technology; Part Number: MCP47CMB22-E/UN
U13 = MCP1501: IC VREF SERIES 0.1% SOT23-6; Manufacturer: Microchip Technology; Part Number: MCP1501T-20E/CHY
U14 = TL431xxDBZR: IC VREF SHUNT ADJ SOT23-3; Manufacturer: Texas Instruments; Part Number: TLV431CDBZR
U16 = ADP122AxxZ-xxx-R7: IC REG LINEAR 3.3V 150MA TSOT5; Manufacturer: Analog Devices; Part Number: ADP121AUJZ-3.3-R7
U17 = MCP6546: IC COMP 1.6V SGL O-D SOT23-5; Manufacturer: Microchip Technology; Part Number: MCP6546T-E/OT
U18 = INA293A: IC CURR SENSE 1 CIRCUIT SOT23-5; Manufacturer: Texas Instruments; Part Number: INA293A1QDBVRQ1
U19 = MCP3426: IC ADC 16BIT SIGMA-DELTA 8DFN; Manufacturer: Microchip Technology; Part Number: MCP3426A0-E/MC
Y1 = ASE-XXXXX-MHZ-X-X: XTAL OSC XO 14.7456MHZ CMOS SMD; Manufacturer: Abracon; Part Number: ASE-14.7456MHZ-LC-T; ClassName: -